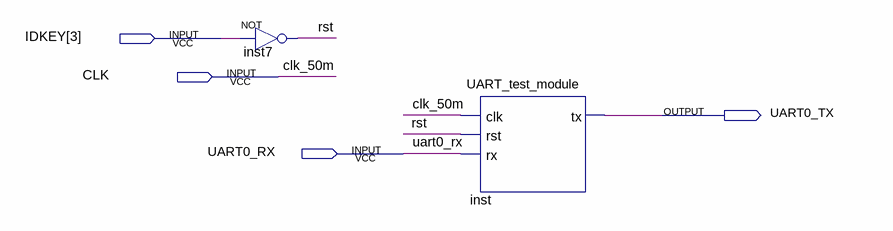
[diagram p0: schematic sheet]
// Quartus schematic Clever_Park.bdf as structural Verilog: 2 symbols, 4 pins
module Clever_Park (
  input  [3:3] IDKEY,
  input  CLK,
  input  UART0_RX,
  output UART0_TX
);

  wire rst;

  not inst7 (rst, IDKEY[3]);
  UART_test_module inst (.clk(CLK), .rst(rst), .rx(UART0_RX), .tx(UART0_TX));

  // Other names for the same wires on the sheet: clk_50m = CLK
endmodule
